# EAGLE schematic fretscanner-INPUTS-minimal (EAGLE 6.6.0)
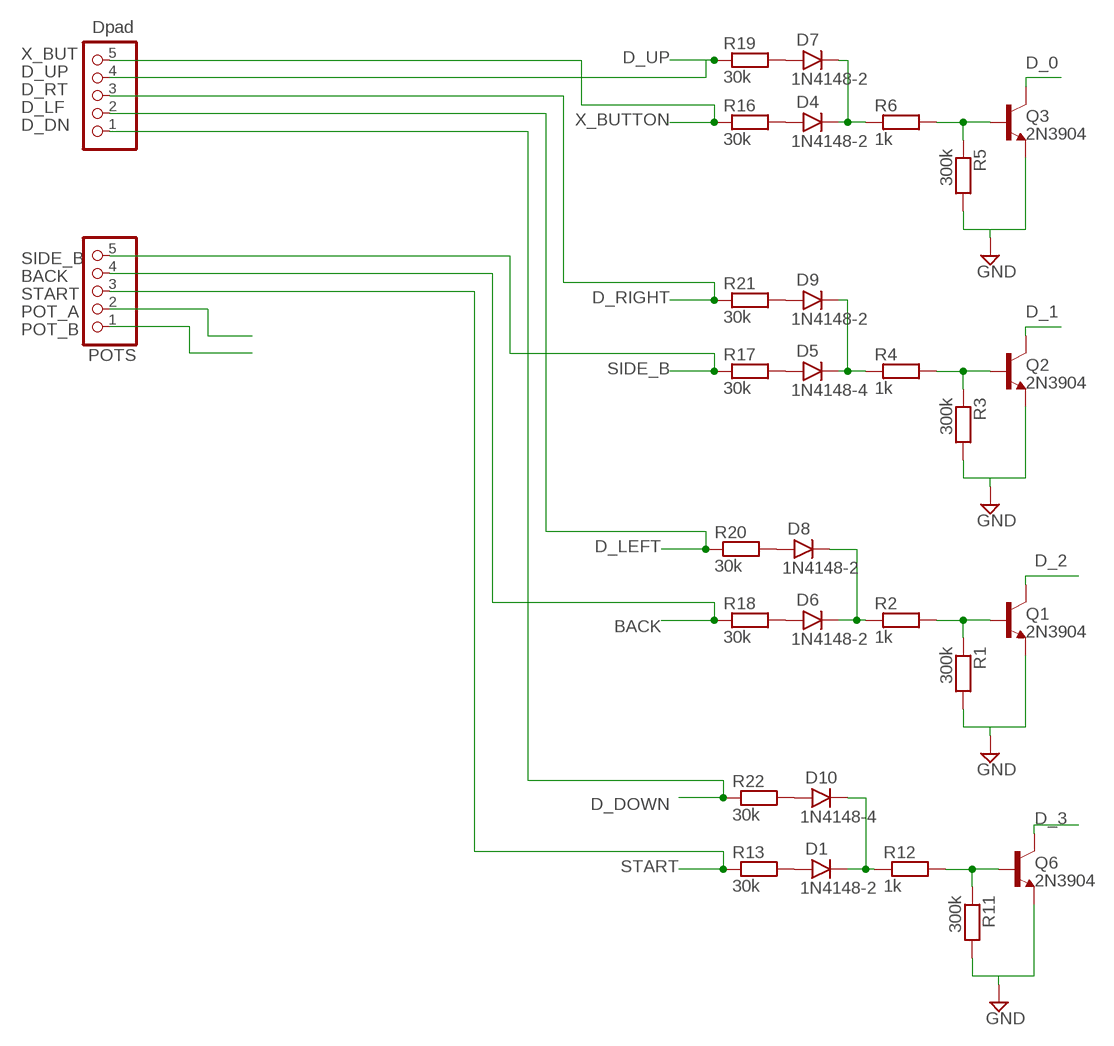
[diagram p0: schematic, sheet 1]

## Parts
D1  1N4148-2  [DO35-2]
D4  1N4148-2  [DO35-2]
D5  1N4148-4  [DO35-4]
D6  1N4148-2  [DO35-2]
D7  1N4148-2  [DO35-2]
D8  1N4148-2  [DO35-2]
D9  1N4148-2  [DO35-2]
D10  1N4148-4  [DO35-4]
DPAD  PINHD-1X5  [1X05]
POTS  PINHD-1X5  [1X05]
Q1  2N3904  [TO92-]
Q2  2N3904  [TO92-]
Q3  2N3904  [TO92-]
Q6  2N3904  [TO92-]
R1  300k  6MM-EU1  [R0207/1V]
R2  1k  6MM-EU1  [R0207/1V]
R3  300k  6MM-EU1  [R0207/1V]
R4  1k  6MM-EU1  [R0207/1V]
R5  300k  6MM-EU1  [R0207/1V]
R6  1k  6MM-EU1  [R0207/1V]
R11  300k  6MM-EU1  [R0207/1V]
R12  1k  6MM-EU1  [R0207/1V]
R13  30k  6MM-EU  [R0207/3]
R16  30k  6MM-EU  [R0207/3]
R17  30k  6MM-EU  [R0207/3]
R18  30k  6MM-EU  [R0207/3]
R19  30k  6MM-EU  [R0207/3]
R20  30k  6MM-EU  [R0207/3]
R21  30k  6MM-EU  [R0207/3]
R22  30k  6MM-EU  [R0207/3]

## Nets
BACK: POTS.4 R18.1
D_0: Q3.1(C)
D_1: Q2.1(C)
D_2: Q1.1(C)
D_3: Q6.1(C)
D_DOWN: DPAD.1 R22.1
D_LEFT: DPAD.2 R20.1
D_RIGHT: DPAD.3 R21.1
D_UP: DPAD.4 R19.1
GND: Q2.3(E) R3.2
N$2: Q2.2(B) R3.1 R4.2
N$4: D5.C D9.C R4.1
N$5: Q3.2(B) R5.1 R6.2
N$6: Q1.2(B) R1.1 R2.2
N$7: D6.C D8.C R2.1
N$8: D4.A R16.2
N$9: D5.A R17.2
N$10: D4.C D7.C R6.1
N$12: D6.A R18.2
N$15: D1.A R13.2
N$18: Q6.2(B) R11.1 R12.2
N$20: D1.C D10.C R12.1
N$21: D7.A R19.2
N$22: D8.A R20.2
N$23: D9.A R21.2
N$24: D10.A R22.2
POT_A: POTS.2
POT_B: POTS.1
SIDE_B: POTS.5 R17.1
START: POTS.3 R13.1
X_BUTTON: DPAD.5 R16.1
Unconnected: Q1.3(E) Q3.3(E) Q6.3(E) R1.2 R5.2 R11.2

## Notes on the sheet
- Dpad
- X_BUT
- D_UP
- D_RT
- D_LF
- D_DN
- SIDE_B
- BACK
- START
- POT_A
- POT_B

## Library data of the parts
D1 D4-D10 = gm-diodes:1N4148: Fast Switching Diode DO-35 glass case a.k.a. 1N914
DPAD POTS = pinhead:PINHD-1X5: PIN HEADER
Q1-Q3 Q6 = gm-trans:2N3904: NPN Transistor
R1-R6 R11-R13 R16-R22 = gm-resistors:6MM-EU: 6mm Resistors (European schematic symbol) Leads spaced 1-6 holes apart for 0.1" perfboard. Suitable for 1/4 watt resistors.